# EAGLE schematic iron (EAGLE 9.0.1)
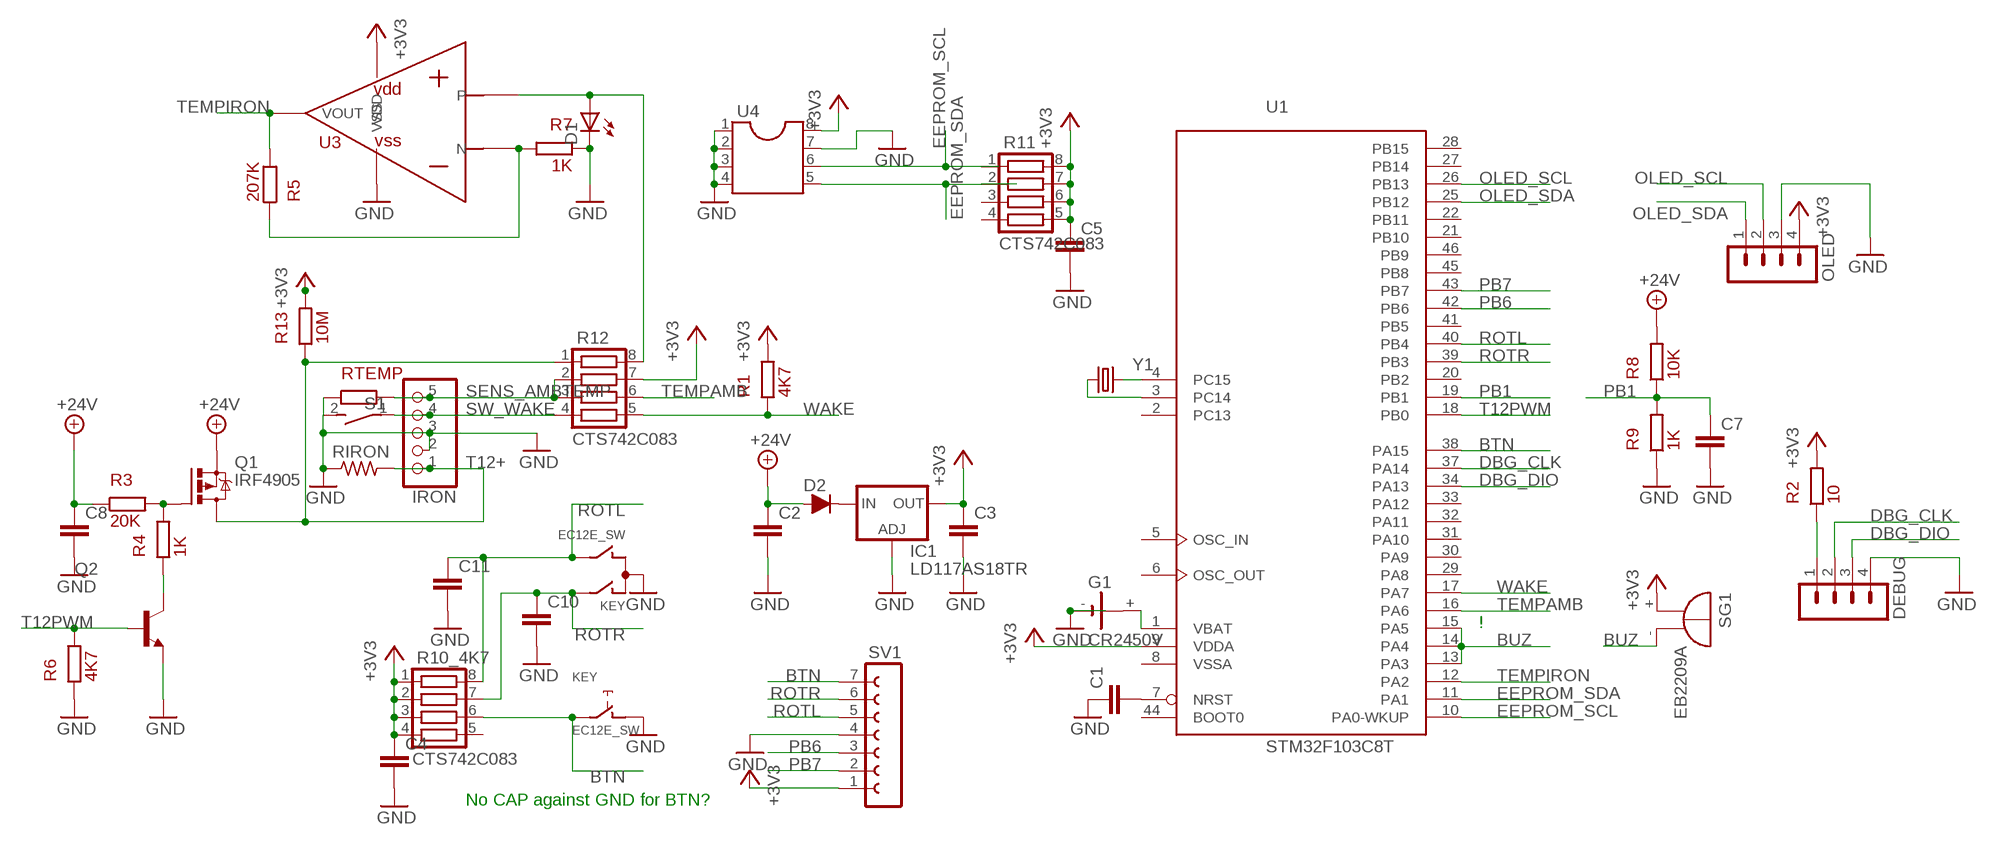
[diagram p0: schematic, sheet 1]

## Parts
C1  C-EUC0603  [C0603]
C2  C-EUC0603  [C0603]
C3  C-EUC0603  [C0603]
C4  C-EUC0603  [C0603]
C5  C-EUC0603  [C0603]
C7  C-EUC0603  [C0603]
C8  C-EUC0603  [C0603]
C10  C-EUC0603  [C0603]
C11  C-EUC0603  [C0603]
D1  LEDCHIP-LED0603  [CHIP-LED0603]
D2  D-FILL-SOD-87  [SOD87]
DEBUG  MA04-1  [MA04-1]
G1  CR2450V  [CR2450V]
IC1  LD117AS18TR  [SOT223]
IRON  PINHD-1X5  [1X05]
KEY  EC12E_SW  [ALPS_EC12E_SW]
OLED  MA04-1  [MA04-1]
Q1  IRF4905  [TO220BH]
Q2  -NPN-SOT23-EBC  [SOT23-EBC]
R1  4K7  R  (no package)
R2  10  R  (no package)
R3  20K  R  (no package)
R4  1K  R  (no package)
R5  207K  R  (no package)
R6  4K7  R  (no package)
R7  1K  R  (no package)
R8  10K  R  (no package)
R9  1K  R  (no package)
R10_4K7  CTS742C083  [CTS742C083]
R11  CTS742C083  [CTS742C083]
R12  CTS742C083  [CTS742C083]
R13  10M  R  (no package)
RIRON  R-US_0204/2V  [0204V]
RTEMP  R  (no package)
S1  DS01E  [DS-01]
SG1  EB2209A  [EB2209A]
SV1  FE07-1  [FE07]
U1  STM32F103C8T  [LQFP48]
U3  OPAMP  (no package)
U4  DIL8  [DIL08]
Y1  KX-4  [1.6X1.2]

## Nets
+3V3: C3.1 C4.1 C5.1 IC1.4(OUT) OLED.4 R1.2 R2.2 R10_4K7.1 R10_4K7.2 R10_4K7.3 R10_4K7.4 R11.5 R11.6 R11.7 R11.8 R12.7 R13.2 SG1.+ SV1.1 U1.9(VDDA) U3.VDD U4.8
+24V: C2.1 C8.1 D2.2(A) Q1.S R3.1 R8.2
BTN: KEY.E R10_4K7.6 SV1.7 U1.38(PA15)
BUZ: SG1.- U1.13(PA3) U1.14(PA4) U1.15(PA5)
DBG_CLK: DEBUG.2 U1.37(PA14)
DBG_DIO: DEBUG.3 U1.34(PA13)
EEPROM_SCL: R11.1 U1.10(PA0-WKUP) U4.6
EEPROM_SDA: R11.2 U1.11(PA1) U4.5
GND: C1.1 C2.2 C3.2 C4.2 C5.2 C7.2 C8.2 C10.2 C11.2 D1.C DEBUG.4 G1.- IC1.1(ADJ) IRON.2 IRON.3 KEY.C KEY.D OLED.3 Q2.E R6.1 R7.1 R9.1 RTEMP.1 S1.2 SV1.4 U3.VSS U4.1 U4.2 U4.3 U4.4 U4.7
N$1: U1.3(PC14) Y1.1
N$2: U1.4(PC15) Y1.3
N$3: Q1.G R3.2 R4.2
N$4: Q2.C R4.1
N$5: D1.A R12.8 U3.P
N$6: C1.2 U1.7(NRST)
N$7: D2.1(C) IC1.3(IN)
N$8: G1.+ U1.1(VBAT)
N$9: DEBUG.1 R2.1
OLED_SCL: OLED.2 U1.26(PB13)
OLED_SDA: OLED.1 U1.25(PB12)
PB1: C7.1 R8.1 R9.2 U1.19(PB1)
PB6: SV1.3 U1.42(PB6)
PB7: SV1.2 U1.43(PB7)
ROTL: C11.1 KEY.B R10_4K7.8 SV1.5 U1.40(PB4)
ROTR: C10.1 KEY.A R10_4K7.7 SV1.6 U1.39(PB3)
SENS_AMBTEMP: IRON.5 R12.2 R12.3 RTEMP.2
SW_WAKE: IRON.4 R12.4 S1.1
T12+: IRON.1 Q1.D R12.1 R13.1 RIRON.2
T12PWM: Q2.B R6.2 U1.18(PB0)
TEMPAMB: R12.6 U1.16(PA6)
TEMPIRON: R5.1 R5.2 R7.2 U1.12(PA2) U3.N U3.VOUT
WAKE: R1.1 R12.5 U1.17(PA7)
Unconnected: G1.+@1(+) KEY.GND1(G) KEY.GND2(G) R10_4K7.5 R11.3 R11.4 RIRON.1 U1.2(PC13) U1.5(OSC_IN) U1.6(OSC_OUT) U1.20(PB2) U1.21(PB10) U1.22(PB11) U1.27(PB14) U1.28(PB15) U1.29(PA8) U1.30(PA9) U1.31(PA10) U1.32(PA11) U1.33(PA12) U1.41(PB5) U1.44(BOOT0) U1.45(PB8) U1.46(PB9)

## Notes on the sheet
- !
- No CAP against GND for BTN?

## Power pins joined to a net without a drawn wire
VDD: U1.24(VDD) U1.36(VDD) U1.48(VDD)
VSS: U1.23(VSS) U1.35(VSS) U1.47(VSS)
VSSA: U1.8(VSSA)

## Library data of the parts
C1-C5 C7 C8 C10 C11 = rcl:C-EU: CAPACITOR, European symbol; SPICEPREFIX: C
D1 = led:LED: LED OSRAM: - CHIPLED LG R971, LG N971, LY N971, LG Q971, LY Q971, LO R971, LY R971 LH N974, LH R974 LS Q976, LO Q976, LY Q976 LO Q996 - Hyper CHIPLED LW Q18S LB Q993, LB Q99A, LB R99A - SideLED LS A670, LO A670, LY A670, LG A670, LP A670 LB A673, LV A673, LT A673, LW A673 LH A674 LY A675 LS A676, LA A676, LO A676, LY A676, LW A676 LS A679, LY A679, LG A679 - Hyper Micro SIDELED® LS Y876, LA Y876, LO Y876, LY Y876 LT Y87S - SmartLED LW L88C, LW L88S LB L89C, LB L89S, LG L890 LS L89K, LO L89K, LY L89K LS L896, LA L896, LO L896, LY L896 - TOPLED LS T670, LO T670, LY T670, LG T670, LP T670 LSG T670, LSP T670, LSY T670, LOP T670, LYG T670 LG T671, LOG T671, LSG T671 LB T673, LV T673, LT T673, LW T673 LH T674 LS T676, LA T676, LO T676, LY T676, LB T676, LH T676, LSB T676, LW T676 LB T67C, LV T67C, LT T67C, LS T67K, LO T67K, LY T67K, LW E67C LS E67B, LA E67B, LO E67B, LY E67B, LB E67C, LV E67C, LT E67C LW T67C LS T679, LY T679, LG T679 LS T770, LO T770, LY T770, LG T770, LP T770 LB T773, LV T773, LT T773, LW T773 LH T774 LS E675, LA E675, LY E675, LS T675 LS T776, LA T776, LO T776, LY T776, LB T776 LHGB T686 LT T68C, LB T68C - Hyper Mini TOPLED® LB M676 - Mini TOPLED Santana® LG M470 LS M47K, LO M47K, LY M47K Source: http://www.osram.convergy.de LUXEON: - LUMILED® LXK2-PW12-R00, LXK2-PW12-S00, LXK2-PW14-U00, LXK2-PW14-V00 LXK2-PM12-R00, LXK2-PM12-S00, LXK2-PM14-U00 LXK2-PE12-Q00, LXK2-PE12-R00, LXK2-PE12-S00, LXK2-PE14-T00, LXK2-PE14-U00 LXK2-PB12-K00, LXK2-PB12-L00, LXK2-PB12-M00, LXK2-PB14-N00, LXK2-PB14-P00, LXK2-PB14-Q00 LXK2-PR12-L00, LXK2-PR12-M00, LXK2-PR14-Q00, LXK2-PR14-R00 LXK2-PD12-Q00, LXK2-PD12-R00, LXK2-PD12-S00 LXK2-PH12-R00, LXK2-PH12-S00 LXK2-PL12-P00, LXK2-PL12-Q00, LXK2-PL12-R00 Source: www.luxeon.com KINGBRIGHT: KA-3528ASYC Source: www.kingbright.com
D2 = semicon-smd-ipc:D-FILL-: DIODE filled
DEBUG OLED = con-lstb:MA04-1: PIN HEADER; OC_FARNELL: unknown; OC_NEWARK: unknown
G1 = battery:CR2450V: LI BATTERY Varta
IC1 = v-reg:LD117A?*: Low drop fixed and adjustable positive voltage regulators 1 A Source: http://www.st.com/stonline/products/literature/ds/7194/ld1117axx.pdf
IRON = pinhead:PINHD-1X5: PIN HEADER
KEY = switch-alps:EC12E_SW: ALPS rotary Encoder EC12E series with switch; MPN: EC12E2424407; OC_FARNELL: 1520813; OC_NEWARK: 74M1068
Q1 = transistor-power:IRF4905: P-Channel HEXFET® Power MOSFET RDS(on)= 0.02 Ohm, ID = -74A Source: http://www.irf.com/product-info/datasheets/data/irf4905pbf.pdf
Q2 = transistor:*-NPN-: NPN Transistror BF959 corrected 2008.03.06
R1-R9 R13 RTEMP = ngspice-simulation:R: RESISTOR
R10_4K7 R11 R12 = resistor-net:CTS742C083: Chip Resistor Array 4 Single Resistor Source: http://www.ctscorp.com/components/Datasheets/CTSChipArrayDs.pdf; OC_FARNELL: unknown; OC_NEWARK: unknown
RIRON = resistor:R-US_: RESISTOR, American symbol
S1 = switch-dil:DS01E: DIL/CODE SWITCH; OC_FARNELL: unknown; OC_NEWARK: unknown
SG1 = buzzer:EB2209A: BUZZER Source: Buerklin; OC_FARNELL: unknown; OC_NEWARK: unknown
SV1 = con-lsta:FE07-1: FEMALE HEADER; OC_FARNELL: unknown; OC_NEWARK: unknown
U1 = micro-stm_v3:STM32F103C*T: ARM 32-bit Cortex™-M3 CPU 72 MHz maximum frequency 16 to 128 Kbytes of Flash memory 6 to 20 kbytes of SRAM 37 GPIOs 2.0 to 3.6 V application supply
U3 = ngspice-simulation:OPAMP: Operational amplifier with power pins
U4 = ic-package:DIL8: Dual In Line / Socket
Y1 = crystal-geyer_V1_0:KX: Quartz Crystals (MHz) SMD: KX - Serie Model Size l/w/h [mm] Frequency Range Frequency Stability Temp. Range [°C] Load Capacitance AECQ 200 availabel Datasheet KX-4 KX-5 KX-6 KX-7 KX-9A KX-9B KX-12A KX-12B KX-13 KX-20 KX-K KX-KS 1.6/1.2/0.3 2.0/1.6/0.45 2.5/2.0/0.55 3.2/2.5/0.8 5.0/3.2/1.0 5.0/3.2/1.1 6.0/3.5/1.1 6.0/3.5/1.0 7.0/5.0 /1.3 11.6/5.5/1.6 12.3/4.5/4.2 12.3/4.5/3.2 24.0 ~ 80.0 MHz 16.0 ~ 80.0 MHz 12.0 ~ 80.0 MHz 8.0 ~ 60.0 MHz 7,68 ~ 300,0 MHz 8,0 ~ 50,0 MHz 8,0 ~ 150,0 MHz 8,0 ~ 50,0 MHz 6,0 ~ 160,0 MHz 3,579 ~ 25,0 MHz 3,579 ~ 70,0 MHz 3,579 ~ 70,0 MHz ±10 … ±50ppm ±10 … ±50ppm ±10 … ±50ppm ±10 … ±50ppm ±10 … ±50ppm ±10 … ±50ppm ±10 … ±50ppm ±10 … ±50ppm ±10 … ±50ppm ±50ppm ±10 … ±50ppm ±10 … ±50ppm (*) -40°C …+85°C (*) -40°C …+125°C (*) -40°C …+125°C (*) -40°C …+125°C (*) -40°C …+105°C (*) -40°C …+105°C (*) -40°C …+125°C (*) -40°C …+105°C (*) -40°C …+105°C (*) -40°C …+105°C (*) -40°C …+85°C (*) -40°C …+85°C 8, 8…16 8, 8…16 10, 8…16 12, 7…20 16, 10…20 16, 10…20 16, 10…20 16, 12…20 16, 12…20 16, 12…20 16, 12…30 16, 12…30 - yes yes yes - - - - - - - - KX-4.pdf <http://www.geyer-electronic.de/uploads/tx_userartikelfrequenz/GEYER-KX-4.pdf> KX-5.pdf <http://www.geyer-electronic.de/uploads/tx_userartikelfrequenz/GEYER-KX-5.pdf> KX-6.pdf <http://www.geyer-electronic.de/uploads/tx_userartikelfrequenz/GEYER-KX-6.pdf> KX-7.pdf <http://www.geyer-electronic.de/uploads/tx_userartikelfrequenz/GEYER-KX-7.pdf> KX-9A.pdf <http://www.geyer-electronic.de/uploads/tx_userartikelfrequenz/GEYER-KX-9A.pdf> KX-9B.pdf <http://www.geyer-electronic.de/uploads/tx_userartikelfrequenz/GEYER-KX-9B.pdf> KX-12A.pdf <http://www.geyer-electronic.de/uploads/tx_userartikelfrequenz/GEYER-KX-12A.pdf> KX-12B.pdf <http://www.geyer-electronic.de/uploads/tx_userartikelfrequenz/GEYER-KX-12B.pdf> KX-13.pdf <http://www.geyer-electronic.de/uploads/tx_userartikelfrequenz/GEYER-KX-13.pdf> KX-20.pdf <http://www.geyer-electronic.de/uploads/tx_userartikelfrequenz/GEYER-KX-20.pdf> KX-K.pdf <http://www.geyer-electronic.de/uploads/tx_userartikelfrequenz/GEYER-KX-K.pdf> KX-KS.pdf <http://www.geyer-electronic.de/uploads/tx_userartikelfrequenz/GEYER-KX-KS.pdf> <http://www.geyer-electronic.de/fileadmin/template/img/logo-geyer-electronic.png> Details see: http://www.geyer-electronic.de/Frequenz-Produkte.9.0.html Created 2016-06-07, Hans Locher 2016 (C) Geyer Quartz Technology KX4,KX5,KX6,KX7,KX9A,KX9B,KX12A,KX12B,KX13,KX20,KXK,KXKS;1612;2016;2520;3225;5032;6035;7050;11655;12345;1,6x1,2;2,0x1,6;2,5x2,0;3,2x2,5;5,0x3,2;6,0x3,5;7,0x5,0;11,6x5,5;12,3x4,5;12,3x4,5;1.6x1.2;2.0x1.6;2.5x2.0;3.2x2.5;5.0x3.2;6.0x3.5;7.0x5.0;11.6x5.5;12.3x4.5;12.3x4.5;